# EAGLE design PowerManagementMysensors (EAGLE 6.5.0)
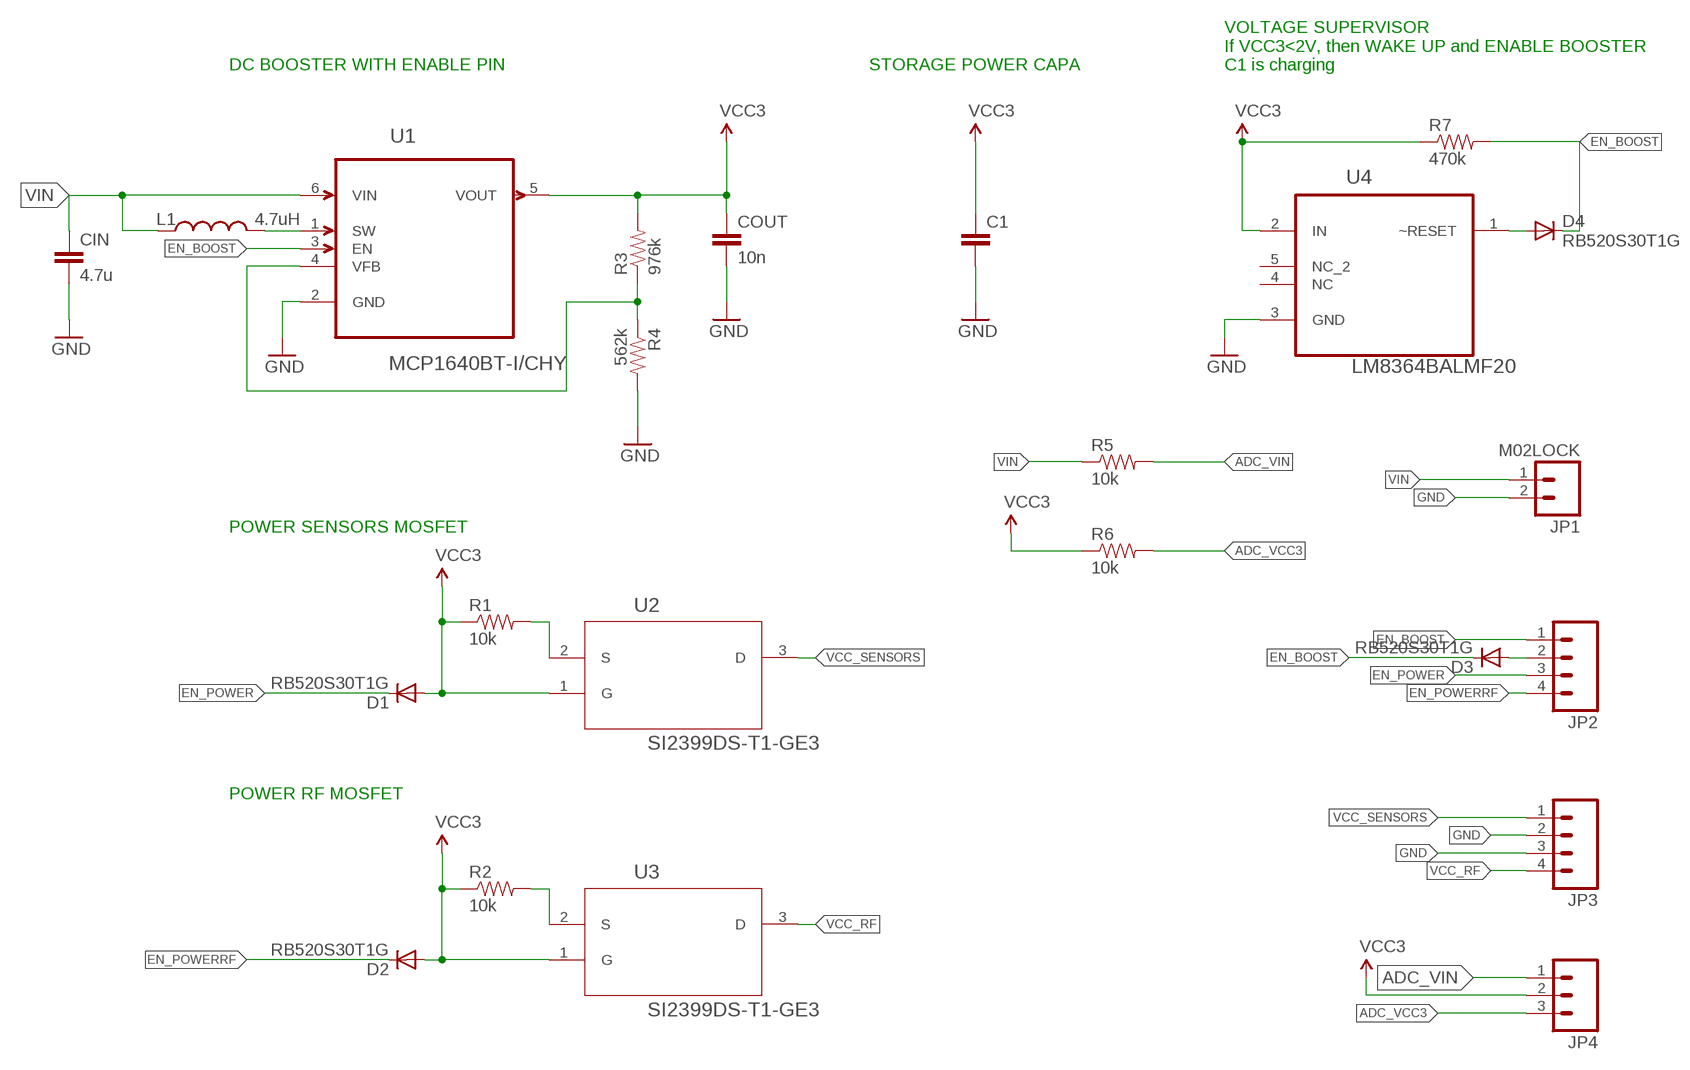
[diagram p0: schematic, sheet 1]

## Parts
C1  CAP1206  [1206]
CIN  4.7u  CAP1206  [1206]
COUT  10n  CAP1206  [1206]
D1  RB520S30T1G  DIODE-SOD523  [SOD523]
D2  RB520S30T1G  DIODE-SOD523  [SOD523]
D3  RB520S30T1G  DIODE-SOD523  [SOD523]
D4  RB520S30T1G  DIODE-SOD523  [SOD523]
JP1  M02LOCK  [1X02_LOCK]
JP2  M04LOCK  [1X04_LOCK]
JP3  M041X04_NO_SILK  [1X04_NO_SILK]
JP4  M03LOCK  [1X03_LOCK]
L1  4.7uH  INDUCTOR1210  [1210]
R1  10k  RESISTOR1206  [1206]
R2  10k  RESISTOR1206  [1206]
R3  976k  RESISTOR1206  [1206]
R4  562k  RESISTOR1206  [1206]
R5  10k  RESISTOR1206  [1206]
R6  10k  RESISTOR1206  [1206]
R7  470k  RESISTOR1206  [1206]
U1  MCP1640BT-I/CHY  [SOT95P270X145-6N]
U2  SI2399DS-T1-GE3  [SOT95P237X112-3N]
U3  SI2399DS-T1-GE3  [SOT95P237X112-3N]
U4  LM8364BALMF20  [SOT95P284X122-5N]

## Nets
ADC_VCC3: JP4.3 R6.2
ADC_VIN: JP4.1 R5.2
EN_BOOST: D3.C D4.C JP2.1 R7.2 U1.3(EN)
EN_POWER: D1.C JP2.3
EN_POWERRF: D2.C JP2.4
GND: C1.2 CIN.2 COUT.2 JP1.2 JP3.2 JP3.3 R4.2 U1.2(GND) U4.3(GND)
N$1: L1.2 U1.1(SW)
N$3: R1.2 U2.2(S)
N$4: R3.1 R4.1 U1.4(VFB)
N$5: D4.A U4.1(~RESET)
N$6: D3.A JP2.2
N$7: R2.2 U3.2(S)
VCC: C1.1 COUT.1 D1.A D2.A JP4.2 R1.1 R2.1 R3.2 R6.1 R7.1 U1.5(VOUT) U2.1(G) U3.1(G) U4.2(IN) ; supply symbol labelled VCC3
VCC_RF: JP3.4 U3.3(D)
VCC_SENSORS: JP3.1 U2.3(D)
VIN: CIN.1 JP1.1 L1.1 R5.1 U1.6(VIN)
Unconnected: U4.4(NC) U4.5(NC_2)

## Notes on the sheet
- DC BOOSTER WITH ENABLE PIN | STORAGE POWER CAPA
- VOLTAGE SUPERVISOR
  If VCC3<2V, then WAKE UP and ENABLE BOOSTER
  C1 is charging
- POWER SENSORS MOSFET
- POWER RF MOSFET

## Library data of the parts
C1 CIN COUT = SparkFun-Passives:CAP: Capacitor Standard 0603 ceramic capacitor, and 0.1" leaded capacitor.
D1-D4 = diode:DIODE-: DIODE
JP1 = SparkFun-Connectors:M02: Standard 2-pin 0.1" header. Use with - straight break away headers ( PRT-00116) - right angle break away headers (PRT-00553) - swiss pins (PRT-00743) - machine pins (PRT-00117) - female headers (PRT-00115) Molex polarized connector foot print use with: PRT-08233 with associated crimp pins and housings. 2.54_SCREWTERM for use with PRT-10571. 3.5mm Screw Terminal footprints for PRT-08084 5mm Screw Terminal footprints for use with PRT-08433
JP2 JP3 = SparkFun-Connectors:M04: Header 4 Standard 4-pin 0.1" header. Use with straight break away headers (SKU : PRT-00116), right angle break away headers (PRT-00553), swiss pins (PRT-00743), machine pins (PRT-00117), and female headers (PRT-00115). Molex polarized connector foot print use with SKU : PRT-08231 with associated crimp pins and housings. 1MM SMD Version SKU: PRT-10208
JP4 = SparkFun-Connectors:M03: Header 3 Standard 3-pin 0.1" header. Use with straight break away headers (SKU : PRT-00116), right angle break away headers (PRT-00553), swiss pins (PRT-00743), machine pins (PRT-00117), and female headers (PRT-00115). Molex polarized connector foot print use with SKU : PRT-08232 with associated crimp pins and housings.
L1 = SparkFun-Passives:INDUCTOR: Inductors Basic Inductor/Choke - 0603 and 1206. Footprints are not proven and vary greatly between part numbers. SRN6045- 33uH, 20% 1.4A SDR0403-560KL - 56uH, 10%, 500mA RMS/740mA peak
R1-R7 = SparkFun-Passives:RESISTOR: Resistor Basic schematic elements and footprints for 0603, 1206, and PTH resistors.
U1 = pmo_lib:MCP1640BT-I/CHY: Synchronous Boost Regulator; MPN: MCP1640BT-I/CHY; OC_FARNELL: 1800207; OC_NEWARK: 73R3625; PACKAGE: SOT-6; SUPPLIER: Microchip
U2 U3 = pmo_lib:SI2399DS-T1-GE3: P-Channel 20-V (D-S) MOSFET; MPN: SI2399DS-T1-GE3; OC_FARNELL: 2056681; OC_NEWARK: 64T4058; PACKAGE: SOT-23-3; SUPPLIER: VISHAY SILICONIX
U4 = pmo_lib:LM8364BALMF20: Micropower Undervoltage Sensing Circuits; MPN: LM8364BALMF20; OC_FARNELL: 9779485; OC_NEWARK: 41K6417; PACKAGE: SOT23-5; SUPPLIER: National Semiconductor

## Net classes
1 Power: width 0.406 mm

## Board
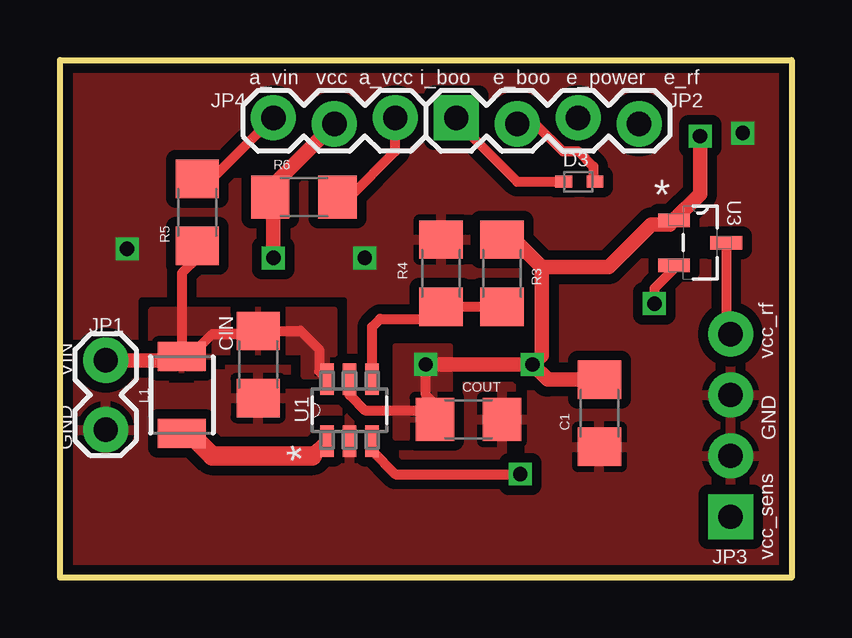
[diagram p1: board, top side]
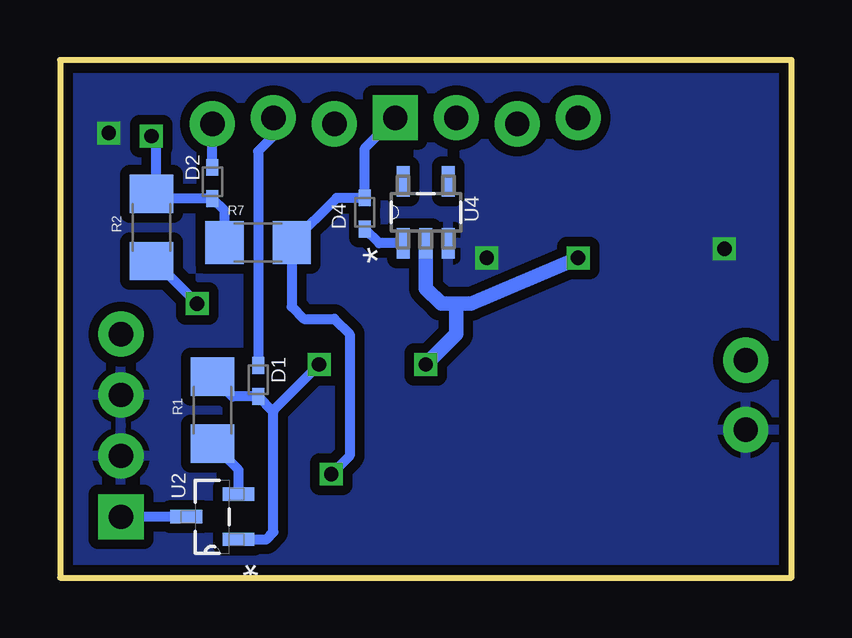
[diagram p2: board, bottom side, seen from below]

Size 30.48 x 21.59 mm. Coordinates in mm from the lower left corner, seen from the top.
Outline: 30.48,0 0,0 0,21.59 30.48,21.59 30.48,0
Copper layers (1*16): Top 0.0356mm / dielectric 1.5011mm / Bottom 0.0356mm
Design rules "LaenPCBOrder": minimum track width 6mil, minimum drill 13mil, track to track 6mil, track to pad 6mil, pad to pad 6mil, via to via 6mil, smd to smd 6mil, copper to edge 15mil, drill to drill 6mil, minimum pad ring 7mil, minimum via ring 7mil, stop-mask expansion 3mil, vias tented up to drill 0mil, thermal gap 10mil

### Footprints (pad centres in the part's own frame; a part is rotated, then mirrored left to right if it is on the bottom)
1206 = smd 1.6 x 1.8: 1 -1.4,0; 2 1.4,0
SOD523 = smd 0.7 x 0.5: A 0.7,0; C -0.6,0
1X02_LOCK = drill 1.016 pad 1.88: 1 -0.178,0; 2 2.718,0
1X04_LOCK = drill 1.016 pad 1.88 square: 1 0,0.127 | drill 1.016 pad 1.88: 2 2.54,-0.127; 3 5.08,0.127; 4 7.62,-0.127
1X04_NO_SILK = drill 1.016 pad 1.88 square: 1 0,0 | drill 1.016 pad 1.88: 2 2.54,0; 3 5.08,0; 4 7.62,0
1X03_LOCK = drill 1.016 pad 1.88: 1 0,0.127; 2 2.54,-0.127; 3 5.08,0.127
1210 = smd 1.2 x 2: 1 -1.6,0; 2 1.6,0
SOT95P270X145-6N = smd 1.321 x 0.559: 1 -1.295,0.94; 2 -1.295,0; 3 -1.295,-0.94; 4 1.295,-0.94; 5 1.295,0; 6 1.295,0.94
SOT95P237X112-3N = smd 1.321 x 0.559: 1 -1.092,0.94; 2 -1.092,-0.94; 3 1.092,0
SOT95P284X122-5N = smd 1.27 x 0.533: 1 -1.295,0.94; 2 -1.295,0; 3 -1.295,-0.94; 4 1.295,-0.94; 5 1.295,0.94

### Placement (x,y rotation side)
C1  22.48,6.86 270 top
CIN  8.26,8.89 270 top
COUT  17.02,6.6 0 top
D1  22.23,8.26 270 bottom
D2  24.13,16.51 270 bottom
D3  21.59,16.51 0 top
D4  17.78,15.24 270 bottom
JP1  1.91,8.89 270 top
JP2  16.51,19.05 0 top
JP3  27.94,2.54 90 top
JP4  8.89,19.05 0 top
L1  5.08,7.62 270 top
R1  24.13,6.99 270 bottom
R2  26.67,14.61 270 bottom
R3  18.41,12.7 90 top
R4  15.88,12.7 90 top
R5  5.71,15.24 90 top
R6  10.16,15.88 0 top
R7  22.23,13.97 0 bottom
U1  12.06,6.99 90 top
U2  24.13,2.54 180 bottom
U3  26.67,13.97 0 top
U4  15.24,15.24 90 bottom

### Tracks (layer width: path | path; a pad name or v marks a point on that pad's centre or on a via)
ADC_VCC3
  Top 0.406: R6.2 12.06,15.88 13.97,17.78 JP4.3
ADC_VIN
  Top 0.406: R5.2 6.35,16.64 JP4.1
EN_BOOST  (via drill 0.6)
  Top 0.406: JP2.1 16.51,19.05 19.05,16.51 D3.C | U1.3 13.01,5.28 13.97,4.32 v19.18,4.32
  Bottom 0.406: JP2.1 17.78,17.91 D4.C 18.95,15.84 R7.2 20.82,11.3 20.32,10.79 19.05,10.79 18.41,10.16 18.41,5.08 v19.18,4.32
EN_POWER
  Bottom 0.406: JP2.3 21.59,18.41 22.23,17.78 D1.C
EN_POWERRF
  Bottom 0.406: D2.C JP2.4
GND  (via drill 0.6)
  other vias: 12.7,13.34 2.79,13.72 28.45,18.54
  pour Top (isolate 0.406, rank 6): -2.79,24.13 32.51,24.13 32.51,-3.81 -2.79,-3.81
  pour Bottom (isolate 0.406): -5.33,25.4 33.78,25.4 33.78,-2.54 -5.33,-2.54
N$1
  Top 0.406: L1.2 5.41,6.02
  Top 0.61: 10.52,5.08 U1.1
  Top 0.813: 5.41,6.02 6.35,5.08 10.52,5.08
N$3
  Bottom 0.406: U2.2 23.04,4.49 R1.2
N$4
  Top 0.406: U1.4 13.01,10.46 13.34,10.79 15.37,10.79 R4.1 R3.1
N$5
  Bottom 0.406: U4.1 17.18,13.95 D4.A
N$6
  Top 0.406: JP2.2 19.81,18.92 20.95,17.78 21.59,17.78 22.23,17.14 22.23,16.57 D3.A
N$7  (via drill 0.6)
  Top 0.406: U3.2 25.58,12.88 24.77,12.06 v24.77,11.43
  Bottom 0.406: R2.2 26.54,13.21 v24.77,11.43
VCC  (via drill 0.6)
  Top 0.406: U1.5 12.06,7.62 12.7,6.99 15.24,6.99 COUT.1 15.62,7.24 15.24,7.62 v15.24,8.89 | 8.76,16.25 R6.1 8.89,15.88
  Top 0.61: 8.76,16.25 JP4.2 | 8.89,15.88 v8.89,13.34 | C1.1 20.32,8.26 v19.68,8.89 | v15.24,8.89 v19.68,8.89 | v26.67,18.41 R2.1 U3.1 25.4,14.73 24.64,14.73 22.86,12.95 20.07,12.95 | R3.2 18.92,14.1 20.07,12.95 | 20.07,12.95 20.07,9.27 v19.68,8.89
  Bottom 0.406: R1.1 23.3,7.55 D1.A 21.59,6.92 | U2.1 21.89,1.6 21.59,1.91 21.59,6.92 | 26.48,15.81 D2.A 23.62,15.3 R7.1 | 26.48,15.81 R2.1 | 26.48,15.81 26.48,18.22 v26.67,18.41 | 21.59,6.92 21.59,6.99 v19.68,8.89
  Bottom 0.61: U4.2 15.24,12.06 14.61,11.43 13.97,11.43 | 13.97,11.43 13.34,11.43 v8.89,13.34 | v15.24,8.89 13.97,10.16 13.97,11.43
  pour Top (isolate 0.406): 13.97,9.65 13.97,5.84 16.26,5.84 16.26,9.65
VCC_RF
  Top 0.406: U3.3 27.76,10.34 JP3.4
VCC_SENSORS
  Bottom 0.406: U2.3 JP3.1
VIN
  Top 0.406: U1.6 10.79,8.61 10.79,9.53 10.03,10.29 CIN.1 8.12,10.16 6.35,10.16 5.41,9.22 L1.1 5.08,12.7 5.71,13.34 R5.1
  Top 0.61: JP1.1 4.93,9.07 L1.1
  pour Top (isolate 0.406): 11.43,8.38 10.16,8.38 10.16,9.4 6.35,9.4 6.35,8.64 3.81,8.64 3.81,11.18 11.43,11.18

### Text on the board
tPlace: a_vin | vcc | a_vcc | i_boo | e_boo | e_power | e_rf | vcc_rf | VIN | GND | GND | vcc_sens